# EAGLE schematic tweakfuzz_redraw (EAGLE 8.5.1)
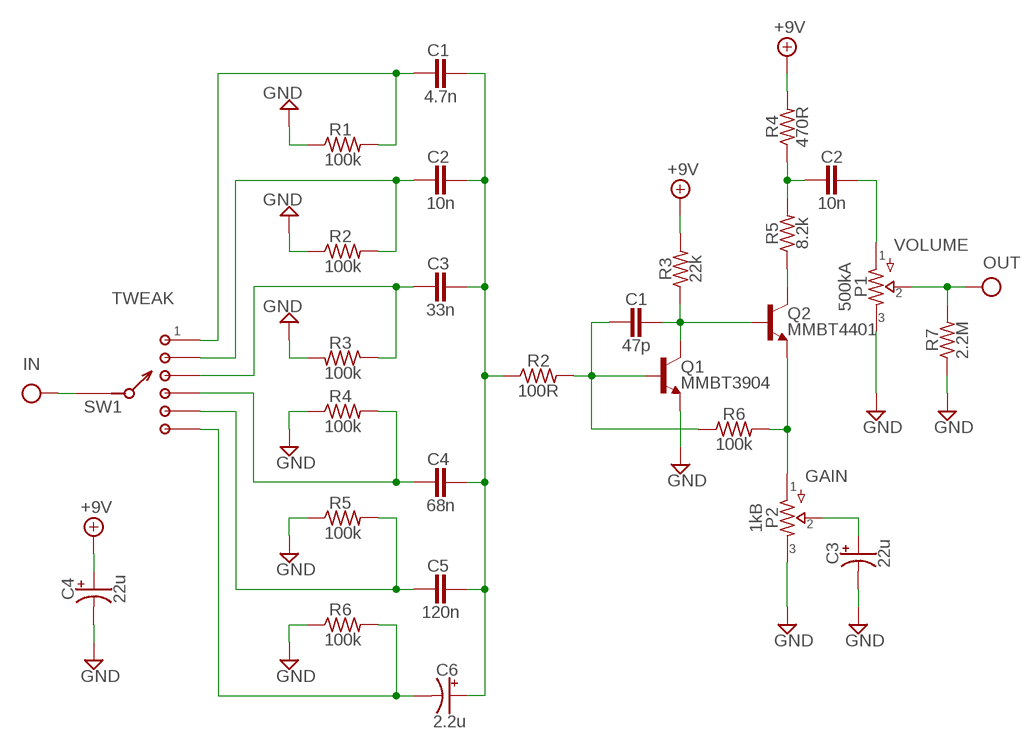
[diagram p0: schematic, sheet 1]

## Parts
C1  47p  CER/FILMBOX.1  [BOX_SMALL]
C1   4.7n  CER/FILMBOX.1  [BOX_SMALL]
C2  10n  CER/FILMBOX.1  [BOX_SMALL]
C2   10n  CER/FILMBOX.1  [BOX_SMALL]
C3  22u  0500  [050_020]
C3   33n  CER/FILMBOX.1  [BOX_SMALL]
C4  22u  0500  [050_020]
C4   68n  CER/FILMBOX.1  [BOX_SMALL]
C5   120n  CER/FILMBOX.1  [BOX_SMALL]
C6   2.2u  0500  [050_020]
P1  500kA  POTS16MM  [16MM]
P2  1kB  POTS16MM  [16MM]
Q1  MMBT3904  2N3904  [TO92-]
Q2  MMBT4401  2N3904  [TO92-]
R1   100k  R_.3B  [R0207/3]
R2  100R  R_.3B  [R0207/3]
R2   100k  R_.3B  [R0207/3]
R3  22k  R_.3B  [R0207/3]
R3   100k  R_.3B  [R0207/3]
R4  470R  R_.3B  [R0207/3]
R4   100k  R_.3B  [R0207/3]
R5  8.2k  R_.3B  [R0207/3]
R5   100k  R_.3B  [R0207/3]
R6  100k  R_.3B  [R0207/3]
R6   100k  R_.3B  [R0207/3]
R7  2.2M  R_.3B  [R0207/3]
SW1  1P6T  [1P6T]

## Nets
+9V: C4.+ R3.2 R4.2
GND: C3.- C4.- P1.3 P2.3 Q1.3(E) R1 .1 R2 .1 R3 .2 R4 .1 R5 .1 R6 .1 R7.1
IN: SW1.7(A)
N$1: C3 .2 R3 .1 SW1.3
N$2: C4 .2 R4 .2 SW1.4
N$4: C1 .2 R1 .2 SW1.1
N$6: C2 .2 R2 .2 SW1.2
N$9: C5 .2 R5 .2 SW1.5
N$10: C6 .- R6 .2 SW1.6
N$11: C1 .1 C2 .1 C3 .1 C4 .1 C5 .1 C6 .+ R2.1
N$12: C1.2 Q1.2(B) R2.2 R6.1
N$13: C1.1 Q1.1(C) Q2.2(B) R3.1
N$15: C2.2 R4.1 R5.2
N$16: Q2.1(C) R5.1
N$17: P2.1 Q2.3(E) R6.2
N$18: C3.+ P2.2
N$19: C2.1 P1.1
OUT: P1.2 R7.2

## Notes on the sheet
- VOLUME
- TWEAK
- GAIN

## Library data of the parts
C1 C1  C2 C2  C3  C4  C5  = pedals-capacitors-film:CER/FILM: 47 - 120pF Xicon Ceramic Disc 2.5mm lead spacing
C3 C4 C6  = pedals-capacitors-elec:050
P1 P2 = pedals-potentiometers:POTS
Q1 Q2 = pedals-transistors:2N3904: NPN Transistor
R1  R2 R2  R3 R3  R4 R4  R5 R5  R6 R6  R7 = pedals-resistors:R_
SW1 = pedals-switches:1P6T